# Altium schematic sheet PCIe Slot.SchDoc
size A3
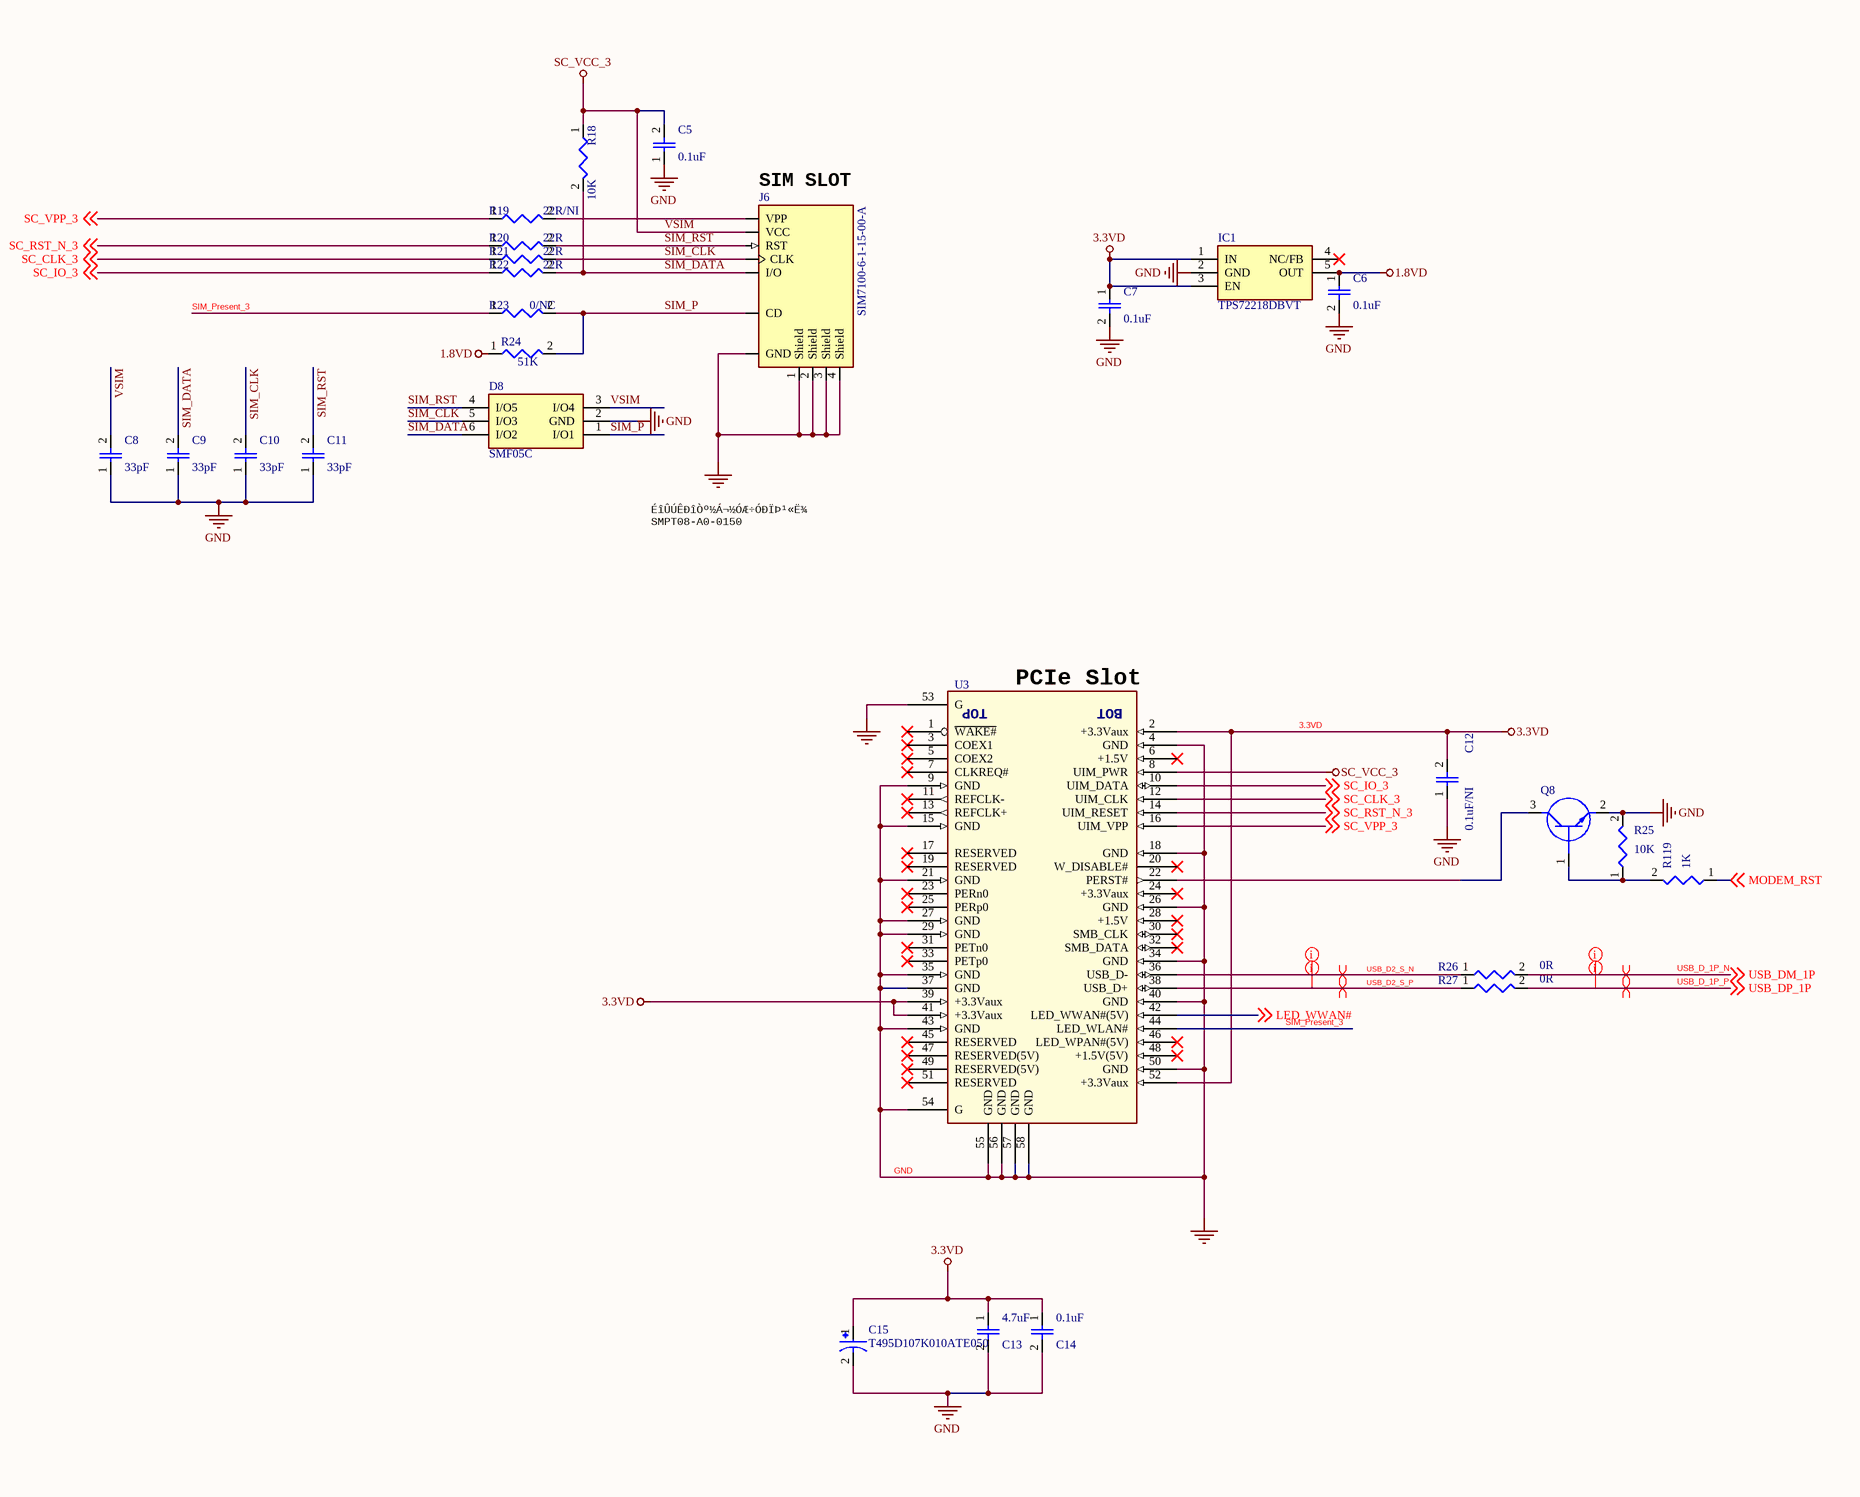
[diagram p0: PCIe Slot.SchDoc, left]
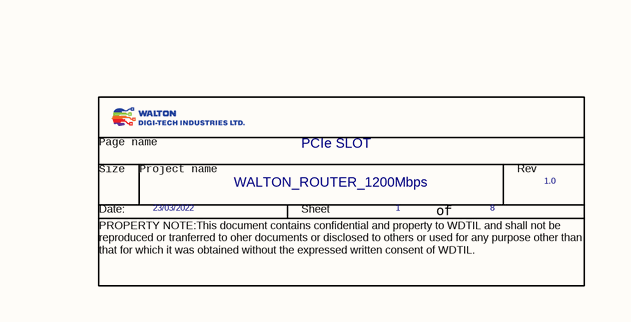
[diagram p1: PCIe Slot.SchDoc, right]

## Parts
*?  Page Number: 1  Page Count: 8  Page Modify Date: 23/03/2022  Doc: WALTON_ROUTER_1200Mbps  RevCode: 1.0  Title: PCIe SLOT  (hidden comment: W_LOGO)  (graphical)
C5  0.1uF  [0603-C]
C6  0.1uF  [0603-C]
C7  0.1uF  [0603-C]
C8  33pF  [0402-C]
C9  33pF  [0402-C]
C10  33pF  [0402-C]
C11  33pF  [0402-C]
C12  0.1uF/NI  [0402-C]
C13  4.7uF  [0603-C]
C14  0.1uF  [0402-C]
C15  T495D107K010ATE050  [CAP_4TAE470ML]
D8  SMF05C  [SOT65P210X110-6N]
IC1  TPS72218DBVT  [SOT95P280X145-5N]
J6  SIM7100-6-1-15-00-A  [GCT_SIM7100-6-1-15-00-A_REVC]
Q8  MMBT2222A-G  [SOT95P240X115-3N]  (value not drawn)
R18  10K  [0402-R]
R19  22R/NI  [0402-R]
R20  22R  [0402-R]
R21  22R  [0402-R]
R22  22R  [0402-R]
R23  0/NC  [0402-R]
R24  51K  [0402-R]
R25  10K  [0402-R]
R26  0R  [0402-R]
R27  0R  [0402-R]
R119  1K  [0402-R]
U3  1759513-1  [TE_1775838-2]  (value not drawn)

## Nets
1.8VD: C6.1 IC1.5(OUT) R24.1
3.3VD: C7.1 C12.2 C13.1 C14.1 C15.1 IC1.1(IN) IC1.3(EN) U3.2(+3.3Vaux) U3.39(+3.3Vaux) U3.41(+3.3Vaux) U3.52(+3.3Vaux)
GND: C5.1 C6.2 C7.2 C8.1 C9.1 C10.1 C11.1 C12.1 C13.2 C14.2 C15.2 D8.2(GND) IC1.2(GND) J6.1(Shield) J6.2(Shield) J6.3(Shield) J6.4(Shield) J6.C5(GND) Q8.2(E) R25.2 U3.4(GND) U3.9(GND) U3.15(GND) U3.18(GND) U3.21(GND) U3.26(GND) U3.27(GND) U3.29(GND) U3.34(GND) U3.35(GND) U3.37(GND) U3.40(GND) U3.43(GND) U3.50(GND) U3.53(G) U3.54(G) U3.55(GND) U3.56(GND) U3.57(GND) U3.58(GND)
VSIM: C5.2 C8.2 D8.3(I/O4) J6.C1(VCC) R18.1 U3.8(UIM_PWR)  [also labelled SC_VCC_3]
LED_WWAN#: U3.42(LED_WWAN#(5V)) ; off-sheet LED_WWAN#
MODEM_RST: R119.1 ; off-sheet MODEM_RST
SC_CLK_3: R21.1 U3.12(UIM_CLK) ; off-sheet SC_CLK_3
SC_IO_3: R22.1 U3.10(UIM_DATA) ; off-sheet SC_IO_3
SC_RST_N_3: R20.1 U3.14(UIM_RESET) ; off-sheet SC_RST_N_3
SC_VPP_3: R19.1 U3.16(UIM_VPP) ; off-sheet SC_VPP_3
SIM_CLK: C10.2 D8.5(I/O3) J6.C3(CLK) R21.2
SIM_DATA: C9.2 D8.6(I/O2) J6.C7(I/O) R18.2 R22.2
SIM_P: D8.1(I/O1) J6.CD R23.2 R24.2
SIM_Present_3: R23.1 U3.44(LED_WLAN#)
SIM_RST: C11.2 D8.4(I/O5) J6.C2(RST) R20.2
USB_D2_S_N: R26.1 U3.36(USB_D-)
USB_D2_S_P: R27.1 U3.38(USB_D+)
USB_D_1P_N: R26.2 ; off-sheet USB_DM_1P  [also labelled USB_DM_1P]
USB_D_1P_P: R27.2 ; off-sheet USB_DP_1P  [also labelled USB_DP_1P]
NetJ6_C6: J6.C6(VPP) R19.2
NetQ8_1: Q8.1(B) R25.1 R119.2
NetQ8_3: Q8.3(C) U3.22(PERST#)

Not connected (* = marked no-connect by the designer): IC1 4(NC/FB)*; U3 1(~{WAKE#})* 3(COEX1)* 5(COEX2)* 6(+1.5V)* 7(CLKREQ#)* 11(REFCLK-)* 13(REFCLK+)* 17(RESERVED)* 19(RESERVED)* 20(W_DISABLE#)* 23(PERn0)* 24(+3.3Vaux)* 25(PERp0)* 28(+1.5V)* 30(SMB_CLK)* 31(PETn0)* 32(SMB_DATA)* 33(PETp0)* 45(RESERVED)* 46(LED_WPAN#(5V))* 47(RESERVED(5V))* 48(+1.5V(5V))* 49(RESERVED(5V))* 51(RESERVED)*

## Layout directives
differential pair; differential pair class DIFF90: USB_D2_S_N, USB_D2_S_P, USB_D_1P_N, USB_D_1P_P
rule Matched Net Lengths [Tolerance = 100mil]: USB_D2_S_N, USB_D2_S_P, USB_D_1P_N, USB_D_1P_P

## Notes on the sheet
- (near J6) SIM SLOT
- ÉîÛÚÊÐîÒº½Á¬½ÓÆ÷ÓÐÏÞ¹«Ë¾
  SMPT08-A0-0150
- (near U3) PCIe Slot
- (in symbol 1775838-2) TOP; BOT
- (in symbol W_LOGO) Page name; Size; Project name; Rev; Date:; Sheet; of; PROPERTY NOTE:This document contains confidential and property to WDTIL and shall not be reproduced or tranferred to oher documents or disclosed to others or used for any purpose other than that for which it was obtained without the expressed written consent of WDTIL.

## Library data of the parts
C5-C7 C12-C14 = CAP
C8-C11 = CAP_2
C15 = T495D107K010ATE050: Cap Tant Solid 100uF 10V D CASE 10% (7.3 X 4.3 X 2.8mm) SMD 7343-31 0.05 Ohm 125°C T/R; Manufacturer: KEMET; ESR (Equivalent Series Resistance): 50mR; Polarity: Polar; Life (Hours): 2000Hour; Dissipation Factor: 8%; Supplier 1: Newark; Manufacturer Part Number: T495D107K010ATE050; RoHS: Yes; Category: Tantalum Capacitors; Stock 1: 224; Pricing 1: 1=2.46000, 10=2.00000, 25=1.84000, 50=1.69000, 100=1.53000 (USD); Mount: Surface Mount; Case/Package: 2917; Number of Pins: 2; Case Code (Imperial): 2917; Case Code (Metric): 7343; Min Operating Temperature: -55°C; Max Operating Temperature: 125°C; Packaging: Tape and Reel; Capacitance: 100uF; Tolerance: 10%; Voltage Rating: 10V; Package Quantity: 500; Termination: SMD/SMT; Voltage Rating (DC): 10V; Features: General Purpose; Series: T495; Construction: Flat; Length: 7.3mm; Width: 4.3mm; Height: 3.1mm; Height - Seated (Max): 0.122inch; Depth: 4.3mm; Radiation Hardening: No; REACH SVHC: No SVHC; RoHS Compliant: Yes; ComponentLink1URL: http://www.farnell.com/datasheets/2319914.pdf?src-supplier=Farnell; ComponentLink1Description: http://www.farnell.com/datasheets/2319914.pdf?src-supplier=Farnell; ComponentLink2URL: http://www.mouser.com/ds/2/212/KEM_T2071_T495_COTS-1104607.pdf?src-supplier=Mouser; ComponentLink2Description: http://www.mouser.com/ds/2/212/KEM_T2071_T495_COTS-1104607.pdf?src-supplier=Mouser; ComponentLink3URL: http://www.farnell.com/datasheets/2015705.pdf?src-supplier=Farnell; ComponentLink3Description: http://www.farnell.com/datasheets/2015705.pdf?src-supplier=Farnell; ComponentLink4URL: http://www.farnell.com/datasheets/2015705.pdf?src-supplier=Element14; ComponentLink4Description: http://www.farnell.com/datasheets/2015705.pdf?src-supplier=Element14; ComponentLink5URL: https://api.kemet.com/component-edge/download/datasheet/T495D107K010ASE100.pdf?src-supplier=Digi-Key; ComponentLink5Description: https://api.kemet.com/component-edge/download/datasheet/T495D107K010ASE100.pdf?src-supplier=Digi-Key; ComponentLink6URL: http://www.kemet.com/Lists/ProductCatalog/Attachments/261/KEM_T2009_T495.pdf?src-supplier=Avnet; ComponentLink6Description: http://www.kemet.com/Lists/ProductCatalog/Attachments/261/KEM_T2009_T495.pdf?src-supplier=Avnet; ComponentLink7URL: http://www.kemet.com/kemet/web/homepage/kechome.nsf/weben/1AABD97F96BDDBDA8525795A0050FFCA/$file/KEM_T2009_T495.pdf?src-supplier=Avnet; ComponentLink7Description: http://www.kemet.com/kemet/web/homepage/kechome.nsf/weben/1AABD97F96BDDBDA8525795A0050FFCA/$file/KEM_T2009_T495.pdf?src-supplier=Avnet; ComponentLink8URL: http://www.farnell.com/datasheets/2319914.pdf?src-supplier=Newark; ComponentLink8Description: http://www.farnell.com/datasheets/2319914.pdf?src-supplier=Newark; ComponentLink9URL: http://components.arrow.com/part/dataview/44988739S8665845N7429?src-supplier=Arrow+Electronics; ComponentLink9Description: http://components.arrow.com/part/dataview/44988739S8665845N7429?src-supplier=Arrow+Electronics; Supplier Part Number 1: 77Y7860
D8 = SMF05C: Diode; Manufacturer_Name: SEMTECH; Datasheet Link: https://semtech.my.salesforce.com/sfc/p/E0000000JelG/a/2R000000HTur/oh5IBNMxy439tUCWCfUixX8WnZBmvf43yHAHJowoBrc; Height: 1.1mm; Manufacturer_Part_Number: SMF05C
IC1 = TPS72218DBVT: Integrated Circuit; Manufacturer_Name: Texas Instruments; Datasheet Link: http://www.ti.com/lit/gpn/tps722; Height: 1.45mm; Manufacturer_Part_Number: TPS72218DBVT; Mouser Part Number: 595-TPS72218DBVT; Mouser Price/Stock: https://www.mouser.co.uk/ProductDetail/Texas-Instruments/TPS72218DBVT?qs=Gse6rAGbi7%2F5%252BPwDKEmoQQ%3D%3D; Arrow Part Number: TPS72218DBVT; Arrow Price/Stock: https://www.arrow.com/en/products/tps72218dbvt/texas-instruments
J6 = SIM7100-6-1-15-00-A_REVC: 7 _6 + 1_ Position Card Connector Micro SIM Surface Mount, Right Angle Gold; MF: Global Connector Technology; Package: None; Availability: Unavailable; SnapEDA_Link: https://www.snapeda.com/parts/SIM7100-6-1-15-00-A/Global%20Connector%20Technology/view-part/449163/?ref=snap; MP: SIM7100-6-1-15-00-A; Price: None; Value: *
Q8 = MMBT2222A-G: Transistor BJT NPN; Manufacturer_Name: Comchip Technology; Datasheet Link: https://datasheet.datasheetarchive.com/originals/distributors/Datasheets-7/DSA-138996.pdf; Height: 1.15mm; Manufacturer_Part_Number: MMBT2222A-G; Mouser Part Number: 750-MMBT2222A-G; Mouser Price/Stock: https://www.mouser.co.uk/ProductDetail/Comchip-Technology/MMBT2222A-G?qs=2qJf6qQ4IOIM%2FSE9iCL8gQ%3D%3D; Arrow Part Number: MMBT2222A-G; Arrow Price/Stock: https://www.arrow.com/en/products/mmbt2222a-g/comchip-technology?region=nac
R18-R24 R26 R27 = Res
R25 R119 = Res_19
U3 = 1775838-2: 0.8MM MINI PCI EXPRESS CONNECTOR 9H